# EAGLE schematic GabozePocaioLayout (EAGLE 9.0.1)
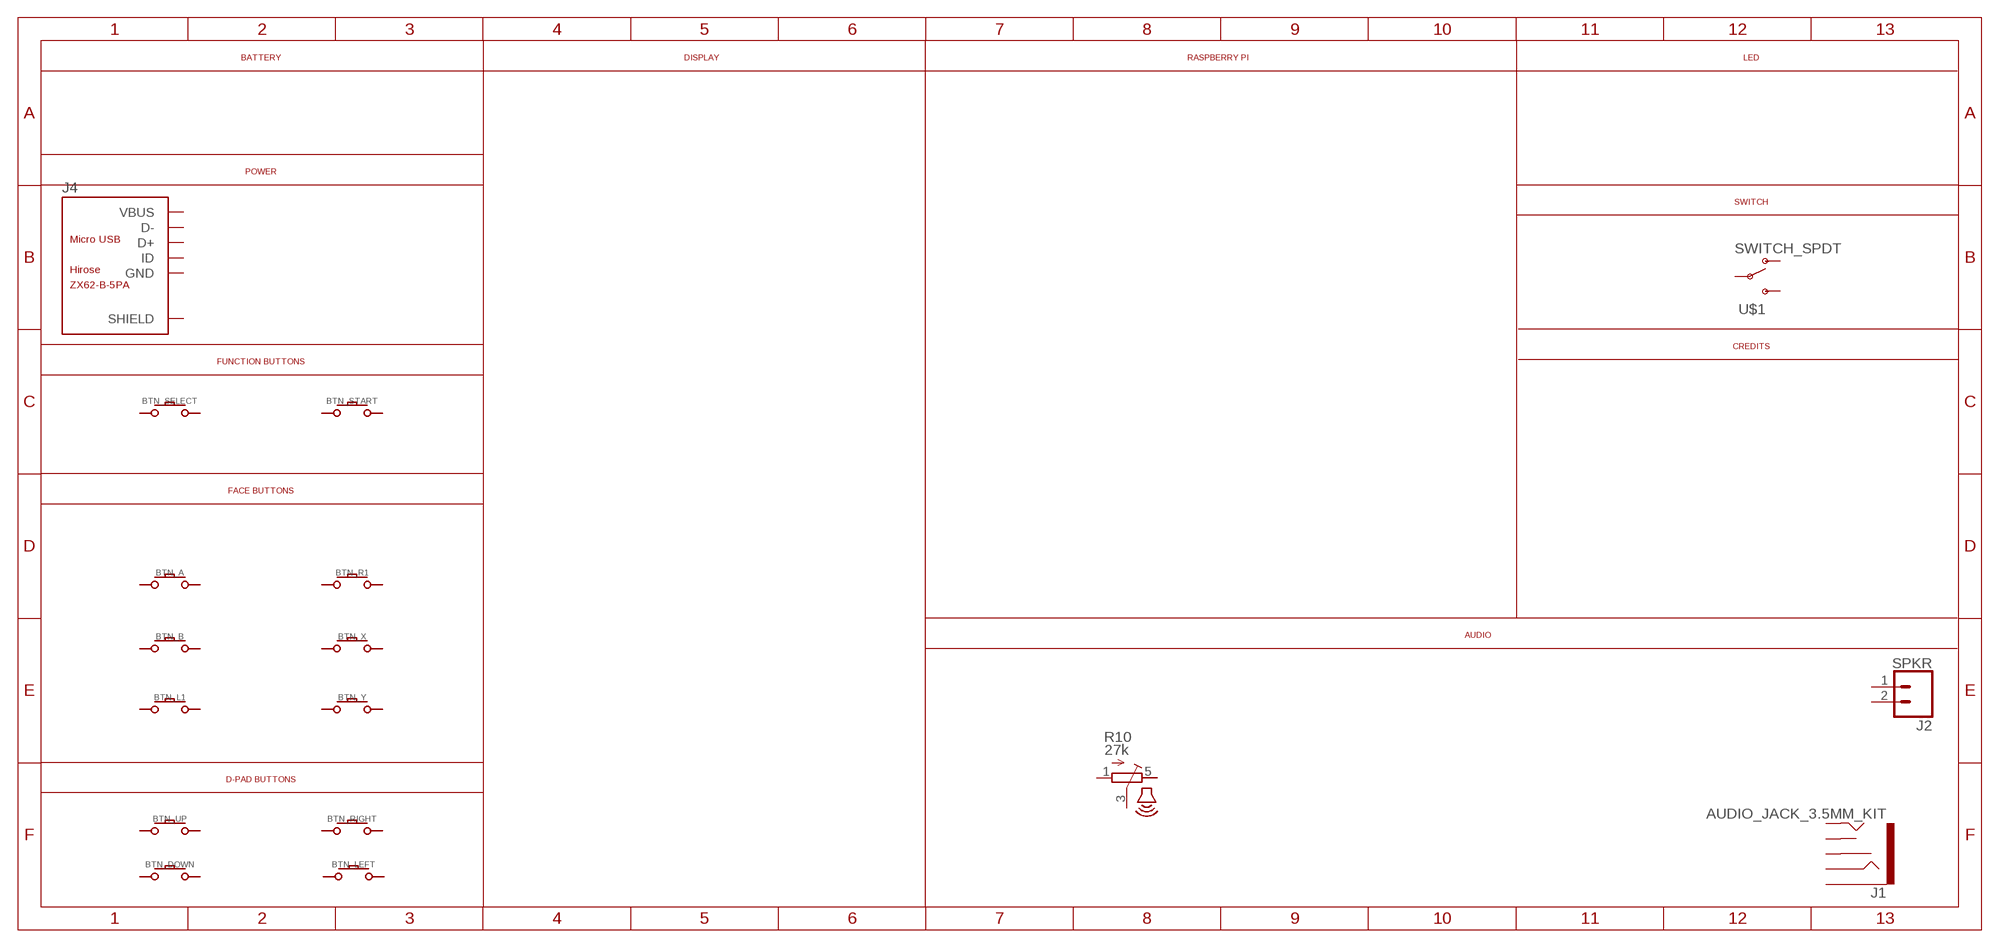
[diagram p0: schematic, sheet 1]

## Parts
BTN_A  CONDUCTIVE_BUTTON  [CONDUCTIVE_BUTTON]
BTN_B  CONDUCTIVE_BUTTON  [CONDUCTIVE_BUTTON]
BTN_DOWN  CONDUCTIVE_BUTTON  [CONDUCTIVE_BUTTON]
BTN_L1  CONDUCTIVE_BUTTON_DRILL  [CONDUCTIVE_BUTTON_DRILL]
BTN_LEFT  CONDUCTIVE_BUTTON  [CONDUCTIVE_BUTTON]
BTN_R1  CONDUCTIVE_BUTTON_DRILL  [CONDUCTIVE_BUTTON_DRILL]
BTN_RIGHT  CONDUCTIVE_BUTTON  [CONDUCTIVE_BUTTON]
BTN_SELECT  CONDUCTIVE_BUTTON_STARTSELECT  [CONDUCTIVE_BUTTON_STARTSELECT]
BTN_START  CONDUCTIVE_BUTTON_STARTSELECT  [CONDUCTIVE_BUTTON_STARTSELECT]
BTN_UP  CONDUCTIVE_BUTTON  [CONDUCTIVE_BUTTON]
BTN_X  CONDUCTIVE_BUTTON_DRILL  [CONDUCTIVE_BUTTON_DRILL]
BTN_Y  CONDUCTIVE_BUTTON_DRILL  [CONDUCTIVE_BUTTON_DRILL]
J1  AUDIO_JACK_3.5MM_KIT  [AUDIO-JACK-KIT]
J2  SPKR  CONN_02  [1X02]
J4  ZX62-B-5PA  MICRO-USB-SMD(ZX62-B-5PA)  [MICRO-USB5+6P-SMD-0.65-AB]
R10  27k  VOLUME  [VOLUME]
U$1  SWITCH_SPDT  [KPS-1290]
Unconnected: BTN_A.P$ACTIVE BTN_A.P$GND BTN_B.P$ACTIVE BTN_B.P$GND BTN_DOWN.P$ACTIVE BTN_DOWN.P$GND BTN_L1.P$ACTIVE BTN_L1.P$GND BTN_LEFT.P$ACTIVE BTN_LEFT.P$GND BTN_R1.P$ACTIVE BTN_R1.P$GND BTN_RIGHT.P$ACTIVE BTN_RIGHT.P$GND BTN_SELECT.P$ACTIVE BTN_SELECT.P$GND BTN_START.P$ACTIVE BTN_START.P$GND BTN_UP.P$ACTIVE BTN_UP.P$GND BTN_X.P$ACTIVE BTN_X.P$GND BTN_Y.P$ACTIVE BTN_Y.P$GND J1.RING J1.RSH J1.SLEEVE J1.TIP J1.TSH J2.1 J2.2 J4.1(VBUS) J4.2(D-) J4.3(D+) J4.4(ID) J4.5(GND) J4.P1(SHIELD) J4.P2(SHIELD) J4.P3(SHIELD) J4.P4(SHIELD) J4.P5(SHIELD) J4.P6(SHIELD) R10.1(A) R10.3(S) R10.5(E) U$1.O U$1.P U$1.S

## Notes on the sheet
- BATTERY | DISPLAY | RASPBERRY PI | LED
- POWER
- SWITCH
- CREDITS
- FUNCTION BUTTONS
- FACE BUTTONS
- AUDIO
- D-PAD BUTTONS

## Library data of the parts
BTN_A BTN_B BTN_DOWN BTN_LEFT BTN_RIGHT BTN_UP = ConductiveButtons:CONDUCTIVE_BUTTON
BTN_L1 BTN_R1 BTN_X BTN_Y = ConductiveButtons:CONDUCTIVE_BUTTON_DRILL
BTN_SELECT BTN_START = ConductiveButtons:CONDUCTIVE_BUTTON_STARTSELECT
J1 = SparkFun-Connectors:AUDIO_JACK_3.5MM: Audio Jack 3.5mm variants of PTH and SMT stereo audio jack with bypass switches. SparkFun Products: SparkFun SparkPunk Sound Kit <[https://www.sparkfun.com/products/11177]> - PTH MP3 Trigger <https://www.sparkfun.com/products/13720> -3.5mm SMD SparkFun PicoBoard <https://www.sparkfun.com/products/11888>- 2.5mm SMD; PROD_ID: CONN-08774; SF_ID: PRT-08032
J2 = SparkFun-Connectors:CONN_02: Multi connection point. Often used as Generic Header-pin footprint for 0.1 inch spaced/style header connections On any of the 0.1 inch spaced packages, you can populate with these: Break Away Headers - Straight <https://www.sparkfun.com/products/116> (PRT-00116) Break Away Male Headers - Right Angle <https://www.sparkfun.com/products/553> (PRT-00553) Female Headers <https://www.sparkfun.com/products/115> (PRT-00115) Break Away Headers - Machine Pin <https://www.sparkfun.com/products/117> (PRT-00117) Break Away Female Headers - Swiss Machine Pin <https://www.sparkfun.com/products/743> (PRT-00743) For SCREWTERMINALS and SPRING TERMINALS visit here: Screw Terimnals on SparkFun.com <https://www.sparkfun.com/search/results?term=Screw+Terminals> (5mm/3.5mm/2.54mm spacing) This device is also useful as a general connection point to wire up your design to another part of your project. Our various solder wires solder well into these plated through hole pads. Hook-Up Wire - Assortment (Stranded, 22 AWG) <https://www.sparkfun.com/products/11375> (PRT-11375) Hook-Up Wire - Assortment (Solid Core, 22 AWG) <https://www.sparkfun.com/products/11367> (PRT-11367) View the entire wire category on our website here <https://www.sparkfun.com/categories/141> Special notes: Molex polarized connector foot print use with: PRT-08233 with associated crimp pins and housings. 2.54_SCREWTERM for use with PRT-10571. 3.5mm Screw Terminal footprints for PRT-08084 5mm Screw Terminal footprints for use with PRT-08432
J4 = Seeed-Connector:MICRO-USB-SMD(ZX62-B-5PA): 320010005; MPN: ZX62-B-5PA
R10 = GBA:VOLUME
U$1 = SparkFun-Retired:SWITCH_SPDT: SWCH-10651 Side-actuated SPDT slide switch, as used on the Arduino Pro; PROD_ID: SWCH-10651